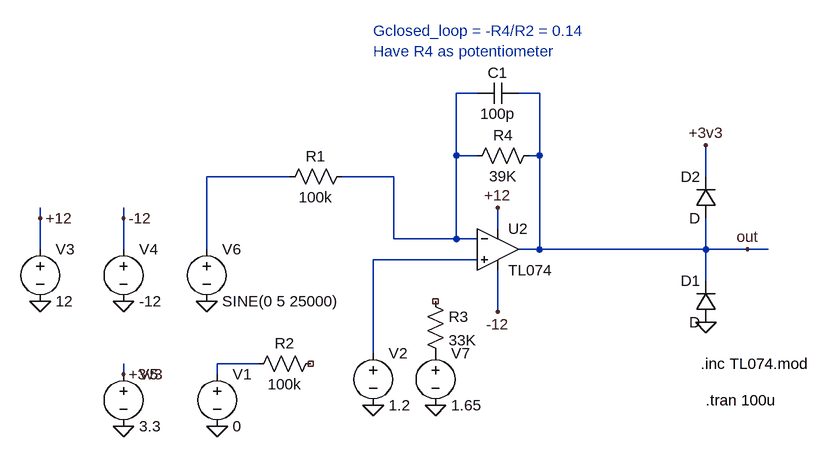
[diagram p0: schematic kasper(1).asc]
kasper(1).asc, the LTspice schematic file:
Version 4
SHEET 1 916 680
WIRE 304 32 272 32
WIRE 400 32 368 32
WIRE 272 128 272 32
WIRE 304 128 272 128
WIRE 400 128 400 32
WIRE 400 128 384 128
WIRE 16 160 -112 160
WIRE 176 160 96 160
WIRE 656 160 656 112
WIRE -368 224 -368 208
WIRE -240 224 -240 208
WIRE 336 240 336 208
WIRE 176 256 176 160
WIRE 272 256 272 128
WIRE 272 256 176 256
WIRE 304 256 272 256
WIRE -368 272 -368 224
WIRE -240 272 -240 224
WIRE -112 272 -112 160
WIRE 400 272 400 128
WIRE 400 272 368 272
WIRE 656 272 656 224
WIRE 656 272 400 272
WIRE 720 272 656 272
WIRE 752 272 720 272
WIRE 304 288 144 288
WIRE 656 320 656 272
WIRE 336 368 336 304
WIRE 144 432 144 288
WIRE -32 448 -96 448
WIRE -240 464 -240 448
WIRE -96 464 -96 448
FLAG -96 544 0
FLAG 720 272 out
FLAG 144 512 0
FLAG -368 352 0
FLAG -240 352 0
FLAG -368 224 +12
FLAG -240 224 -12
FLAG 336 208 +12
FLAG 336 368 -12
FLAG -240 464 +3v3
FLAG -240 544 0
FLAG 656 384 0
FLAG 656 112 +3v3
FLAG -112 352 0
FLAG 240 512 0
SYMBOL voltage -96 448 R0
SYMATTR InstName V1
SYMATTR Value 0
SYMATTR Value2 AC 11
SYMBOL Opamps/opamp2 336 208 R0
SYMATTR InstName U2
SYMATTR Value TL074
SYMBOL res 400 112 R90
WINDOW 0 0 56 VBottom 2
WINDOW 3 32 56 VTop 2
SYMATTR InstName R4
SYMATTR Value 39K
SYMBOL voltage 144 416 R0
SYMATTR InstName V2
SYMATTR Value 1.2
SYMBOL voltage -368 256 R0
SYMATTR InstName V3
SYMATTR Value 12
SYMBOL voltage -240 256 R0
SYMATTR InstName V4
SYMATTR Value -12
SYMBOL voltage -240 448 R0
SYMATTR InstName V5
SYMATTR Value 3.3
SYMBOL diode 672 384 R180
WINDOW 0 24 64 Left 2
WINDOW 3 24 0 Left 2
SYMATTR InstName D1
SYMBOL diode 672 224 R180
WINDOW 0 24 64 Left 2
WINDOW 3 24 0 Left 2
SYMATTR InstName D2
SYMBOL res -48 464 R270
WINDOW 0 32 56 VTop 2
WINDOW 3 0 56 VBottom 2
SYMATTR InstName R2
SYMATTR Value 100k
SYMBOL cap 368 16 R90
WINDOW 0 0 32 VBottom 2
WINDOW 3 32 32 VTop 2
SYMATTR InstName C1
SYMATTR Value 100p
SYMBOL voltage -112 256 R0
SYMATTR InstName V6
SYMATTR Value SINE(0 5 25000)
SYMATTR Value2 AC 11
SYMBOL res 112 144 R90
WINDOW 0 0 56 VBottom 2
WINDOW 3 32 56 VTop 2
SYMATTR InstName R1
SYMATTR Value 100k
SYMBOL voltage 240 416 R0
SYMATTR InstName V7
SYMATTR Value 1.65
SYMBOL res 224 336 R0
SYMATTR InstName R3
SYMATTR Value 33K
TEXT 648 448 Left 2 !.inc TL074.mod
TEXT 656 504 Left 2 !.tran 100u
TEXT 144 -64 Left 2 ;Gclosed_loop = -R4/R2 = 0.14\nHave R4 as potentiometer

The netlist it stands for:
* kasper(1).asc
V1 N004 0 0 AC 11
XU2 N003 N001 +12 -12 out TL074  ; pins In+ In- V+ V- OUT
R4 out N001 39K
V2 N003 0 1.2
V3 +12 0 12
V4 -12 0 -12
V5 +3v3 0 3.3
D1 0 out D
D2 out +3v3 D
R2 N004 NC_01 100k
C1 out N001 100p
V6 N002 0 SINE(0 5 25000) AC 11
R1 N001 N002 100k
V7 P001 0 1.65
R3 NC_02 P001 33K
.model D D
.lib standard.dio
.inc TL074.mod
.tran 100u
* Gclosed_loop = -R4/R2 = 0.14
* Have R4 as potentiometer
.backanno
.end